# EAGLE design lcdconnector2 (EAGLE 6.1)
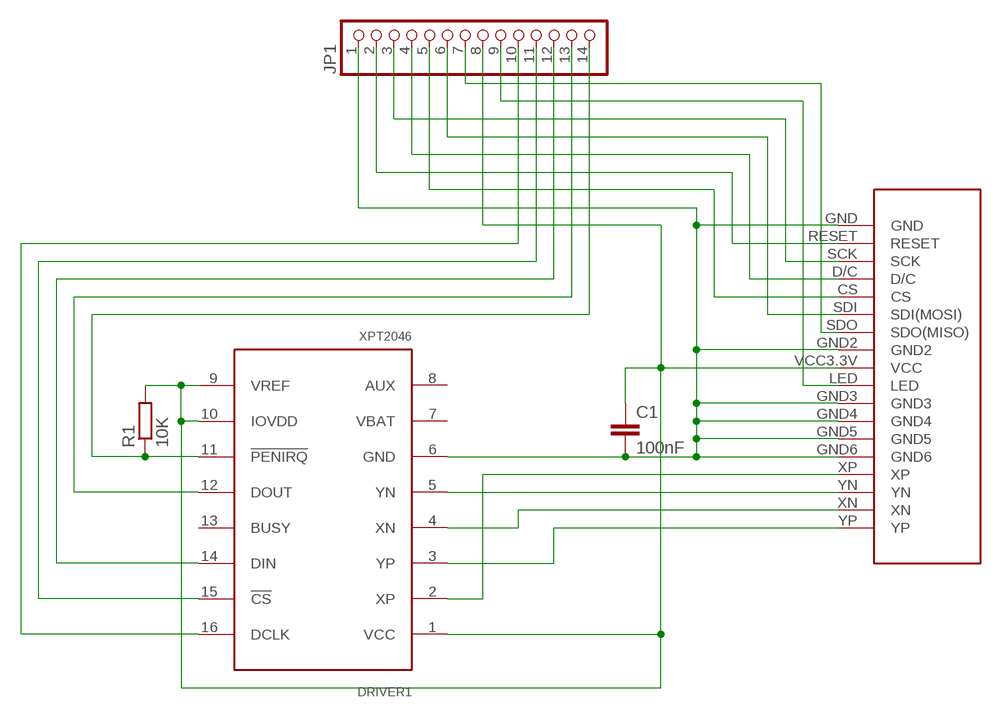
[diagram p0: schematic, sheet 1]

## Parts
C1  100nF  C-EUC0805K  [C0805K]
CONNECTOR1  TJCTM24024-PINS  [TJCTM24024-PINS]
DRIVER1  XPT2046  [XPT2046]
JP1  PINHD-1X14-CB  [1X14-CB]
R1  10K  R-EU_M0805  [M0805]

## Nets
N$1: CONNECTOR1.XP DRIVER1.2(XP)
N$2: CONNECTOR1.YP DRIVER1.3(YP)
N$3: CONNECTOR1.XN DRIVER1.4(XN)
N$4: CONNECTOR1.YN DRIVER1.5(YN)
N$5: C1.2 CONNECTOR1.GND CONNECTOR1.GND2 CONNECTOR1.GND3 CONNECTOR1.GND4 CONNECTOR1.GND5 CONNECTOR1.GND6 DRIVER1.6(GND) JP1.1
N$11: CONNECTOR1.CS JP1.5
N$12: CONNECTOR1.RESET JP1.2
N$13: CONNECTOR1.D/C JP1.4
N$14: CONNECTOR1.SDI(SDI(MOSI)) JP1.6
N$15: CONNECTOR1.SCK JP1.3
N$16: CONNECTOR1.LED JP1.9
N$17: CONNECTOR1.SDO(SDO(MISO)) JP1.7
N$18: DRIVER1.16(DCLK) JP1.10
N$19: DRIVER1.15(!CS) JP1.11
N$20: DRIVER1.14(DIN) JP1.12
N$21: DRIVER1.12(DOUT) JP1.13
N$22: DRIVER1.11(!PENIRQ) JP1.14 R1.1
N$23: C1.1 CONNECTOR1.VCC3.3V(VCC) DRIVER1.1(VCC) DRIVER1.9(VREF) DRIVER1.10(IOVDD) JP1.8 R1.2
Unconnected: DRIVER1.7(VBAT) DRIVER1.8(AUX) DRIVER1.13(BUSY)

## Library data of the parts
C1 = rcl:C-EU: CAPACITOR, European symbol
CONNECTOR1 = uradmonitor:TJCTM24024-PINS
DRIVER1 = uradmonitor:XPT2046
JP1 = adafruit:PINHD-1X14: PIN HEADER
R1 = rcl:R-EU_: RESISTOR, European symbol

## Net classes
1 power: width 0.254 mm

## Board
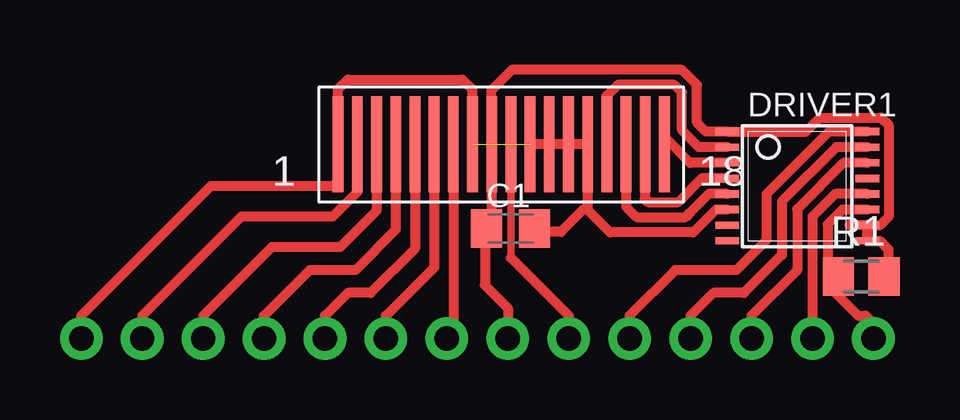
[diagram p1: board, top side]

No outline drawn. Coordinates in mm, seen from the top.
Copper layers (1*16): Top 0.035mm / dielectric 1.5mm / Bottom 0.035mm
Design rules: minimum track width 10mil, minimum drill 24mil, track to track 8mil, track to pad 8mil, pad to pad 8mil, via to via 8mil, smd to smd 8mil, copper to edge 40mil, drill to drill 8mil, minimum pad ring 10mil, minimum via ring 8mil, stop-mask expansion 4mil, vias tented up to drill 0mil, thermal gap 10mil

### Footprints (pad centres in the part's own frame; a part is rotated, then mirrored left to right if it is on the bottom)
C0805K = smd 1.3 x 1.6: 1 -1,0; 2 1,0
TJCTM24024-PINS = smd 0.45 x 4: CS -8,-0.8; D/C -8.8,-0.8; GND -11.2,-0.8; GND2 -5.6,-0.8; GND3 -3.2,-0.8; GND4 -2.4,-0.8; GND5 -1.6,-0.8; GND6 -0.8,-0.8; LED -4,-0.8; RESET -10.4,-0.8; SCK -9.6,-0.8; SDI -7.2,-0.8; SDO -6.4,-0.8; VCC3.3V -4.8,-0.8; XN 1.6,-0.8; XP 0,-0.8; YN 0.8,-0.8; YP 2.4,-0.8
XPT2046 = smd 0.305 x 0.991: 1 -8.625,-1.648; 2 -7.975,-1.648; 3 -7.325,-1.648; 4 -6.675,-1.648; 5 -6.025,-1.648; 6 -5.375,-1.648; 7 -4.725,-1.648; 8 -4.075,-1.648; 9 -4.075,4.188; 10 -4.725,4.188; 11 -5.375,4.188; 12 -6.025,4.188; 13 -6.675,4.188; 14 -7.325,4.188; 15 -7.975,4.188; 16 -8.625,4.188
1X14-CB = drill 1.016 pad 1.778: 1 -16.51,0; 2 -13.97,0; 3 -11.43,0; 4 -8.89,0; 5 -6.35,0; 6 -3.81,0; 7 -1.27,0; 8 1.27,0; 9 3.81,0; 10 6.35,0; 11 8.89,0; 12 11.43,0; 13 13.97,0; 14 16.51,0
M0805 = smd 1.3 x 1.6: 1 -0.95,0; 2 0.95,0

### Placement (x,y rotation side)
C1  57.27,80.78 0 top
CONNECTOR1  61.28,85.09 0 top
DRIVER1  67.94,76.2 270 top
JP1  55.88,76.2 0 top
R1  71.88,78.78 0 top

### Tracks (layer width: path | path; a pad name or v marks a point on that pad's centre or on a via)
N$1
  Top 0.406: DRIVER1.2 65.12,84.17 64.41,84.88 64.41,86.46 64.09,86.77 61.73,86.77 61.26,86.3 61.28,86.28 CONNECTOR1.XP
N$2
  Top 0.406: DRIVER1.3 64.75,83.53 63.82,84.45 63.68,84.31 CONNECTOR1.YP
N$3
  Top 0.406: CONNECTOR1.XN 62.87,84.28 62.87,82.02 62.99,81.89 64.25,81.89 65.24,82.88 DRIVER1.4
N$4
  Top 0.406: CONNECTOR1.YN 62.08,81.7 62.52,81.26 64.57,81.26 64.72,81.42 | DRIVER1.5 65.53,82.22 64.72,81.42 | 64.72,81.42
N$5  (1 unrouted)
  Top 0.406: DRIVER1.6 65.83,81.58 64.88,80.63 61.42,80.63 60.47,81.58 60.48,81.58 | 60.48,81.58 CONNECTOR1.GND6 CONNECTOR1.GND5 CONNECTOR1.GND4 CONNECTOR1.GND3 | JP1.1 39.37,77.15 44.77,82.55 49.85,82.55 50.08,82.78 CONNECTOR1.GND 50.08,86.59 50.48,87 55.24,87 55.68,86.56 CONNECTOR1.GND2 | 60.48,81.58 60.31,81.58 59.37,80.64 58.4,80.64 C1.2
N$6  (via drill 0.6)
  other vias: 39.37,76.2
N$7  (via drill 0.6)
  other vias: 41.91,76.2
N$8  (via drill 0.6)
  other vias: 44.45,76.2
N$9  (via drill 0.6)
  other vias: 46.99,76.2
N$10  (via drill 0.6)
  other vias: 49.53,76.2
N$11
  Top 0.406: CONNECTOR1.CS 53.28,79.95 51.44,78.11 50.48,78.11 49.53,77.15 JP1.5
N$12
  Top 0.406: CONNECTOR1.RESET 50.88,82.31 49.85,81.28 46.04,81.28 41.91,77.15 JP1.2
N$13
  Top 0.406: CONNECTOR1.D/C 52.48,80.73 50.8,79.06 48.9,79.06 46.99,77.15 JP1.4
N$14
  Top 0.406: CONNECTOR1.SDI 54.08,79.16 52.07,77.15 JP1.6
N$15
  Top 0.406: CONNECTOR1.SCK 51.68,81.52 50.16,80.01 47.31,80.01 44.45,77.15 JP1.3
N$16
  Top 0.305: CONNECTOR1.LED 57.28,79.56
  Top 0.406: 57.28,79.56 59.69,77.15 JP1.9
N$17
  Top 0.406: CONNECTOR1.SDO 54.88,76.47 JP1.7
N$18
  Top 0.406: DRIVER1.16 70.54,84.83 67.94,82.23 67.94,80.33 66.67,79.06 64.14,79.06 62.23,77.15 JP1.10
N$19
  Top 0.406: DRIVER1.15 70.84,84.17 68.58,81.92 68.58,79.69 66.99,78.11 65.72,78.11 64.77,77.15 JP1.11
N$20
  Top 0.406: DRIVER1.14 71.14,83.53 69.22,81.6 69.22,79.06 67.31,77.15 JP1.12
N$21
  Top 0.406: DRIVER1.12 70.8,82.22 69.85,81.28 JP1.13
N$22
  Top 0.406: DRIVER1.11 71.1,81.58 70.48,80.96 70.48,78.74 70.53,78.78 R1.1 70.57,78.42 70.48,78.42 71.75,77.15 72.07,77.15 72.39,76.83 JP1.14
N$23
  Top 0.406: DRIVER1.10 71.4,80.92 | DRIVER1.10 72.67,80.92 73.03,81.28 73.03,85.09 72.71,85.41 70.17,85.41 69.58,84.83 DRIVER1.1 65.41,84.83 65.04,85.2 65.04,86.77 64.41,87.4 57.32,87.4 56.48,86.56 CONNECTOR1.VCC3.3V 56.48,80.92 56.34,80.78 | DRIVER1.10 DRIVER1.9 72.66,80.28 73.02,79.91 73.02,78.74 73.03,78.74 72.79,78.74 | 72.79,78.74 R1.2 | 56.34,80.78 56.2,80.64 56.2,78.42 57.15,77.47 JP1.8 | C1.1 56.34,80.78 | 72.79,78.74 72.71,78.74
N$24  (via drill 0.6)
  other vias: 52.07,76.2
N$25  (via drill 0.6)
  other vias: 54.61,76.2
N$26  (via drill 0.6)
  other vias: 57.15,76.2
N$27  (via drill 0.6)
  other vias: 59.69,76.2
N$28  (via drill 0.6)
  other vias: 62.23,76.2
N$29  (via drill 0.6)
  other vias: 64.77,76.2
N$30  (via drill 0.6)
  other vias: 67.31,76.2
N$31  (via drill 0.6)
  other vias: 69.85,76.2
N$32  (via drill 0.6)
  other vias: 72.39,76.2